# EAGLE design BLE112 Breakout Board v2.2 (EAGLE 7.5.0)
BLE112 Breakout Board v2.0 Full breakout board for all BLE112 functions, with optional LEDs, programming header, USB access, etc.
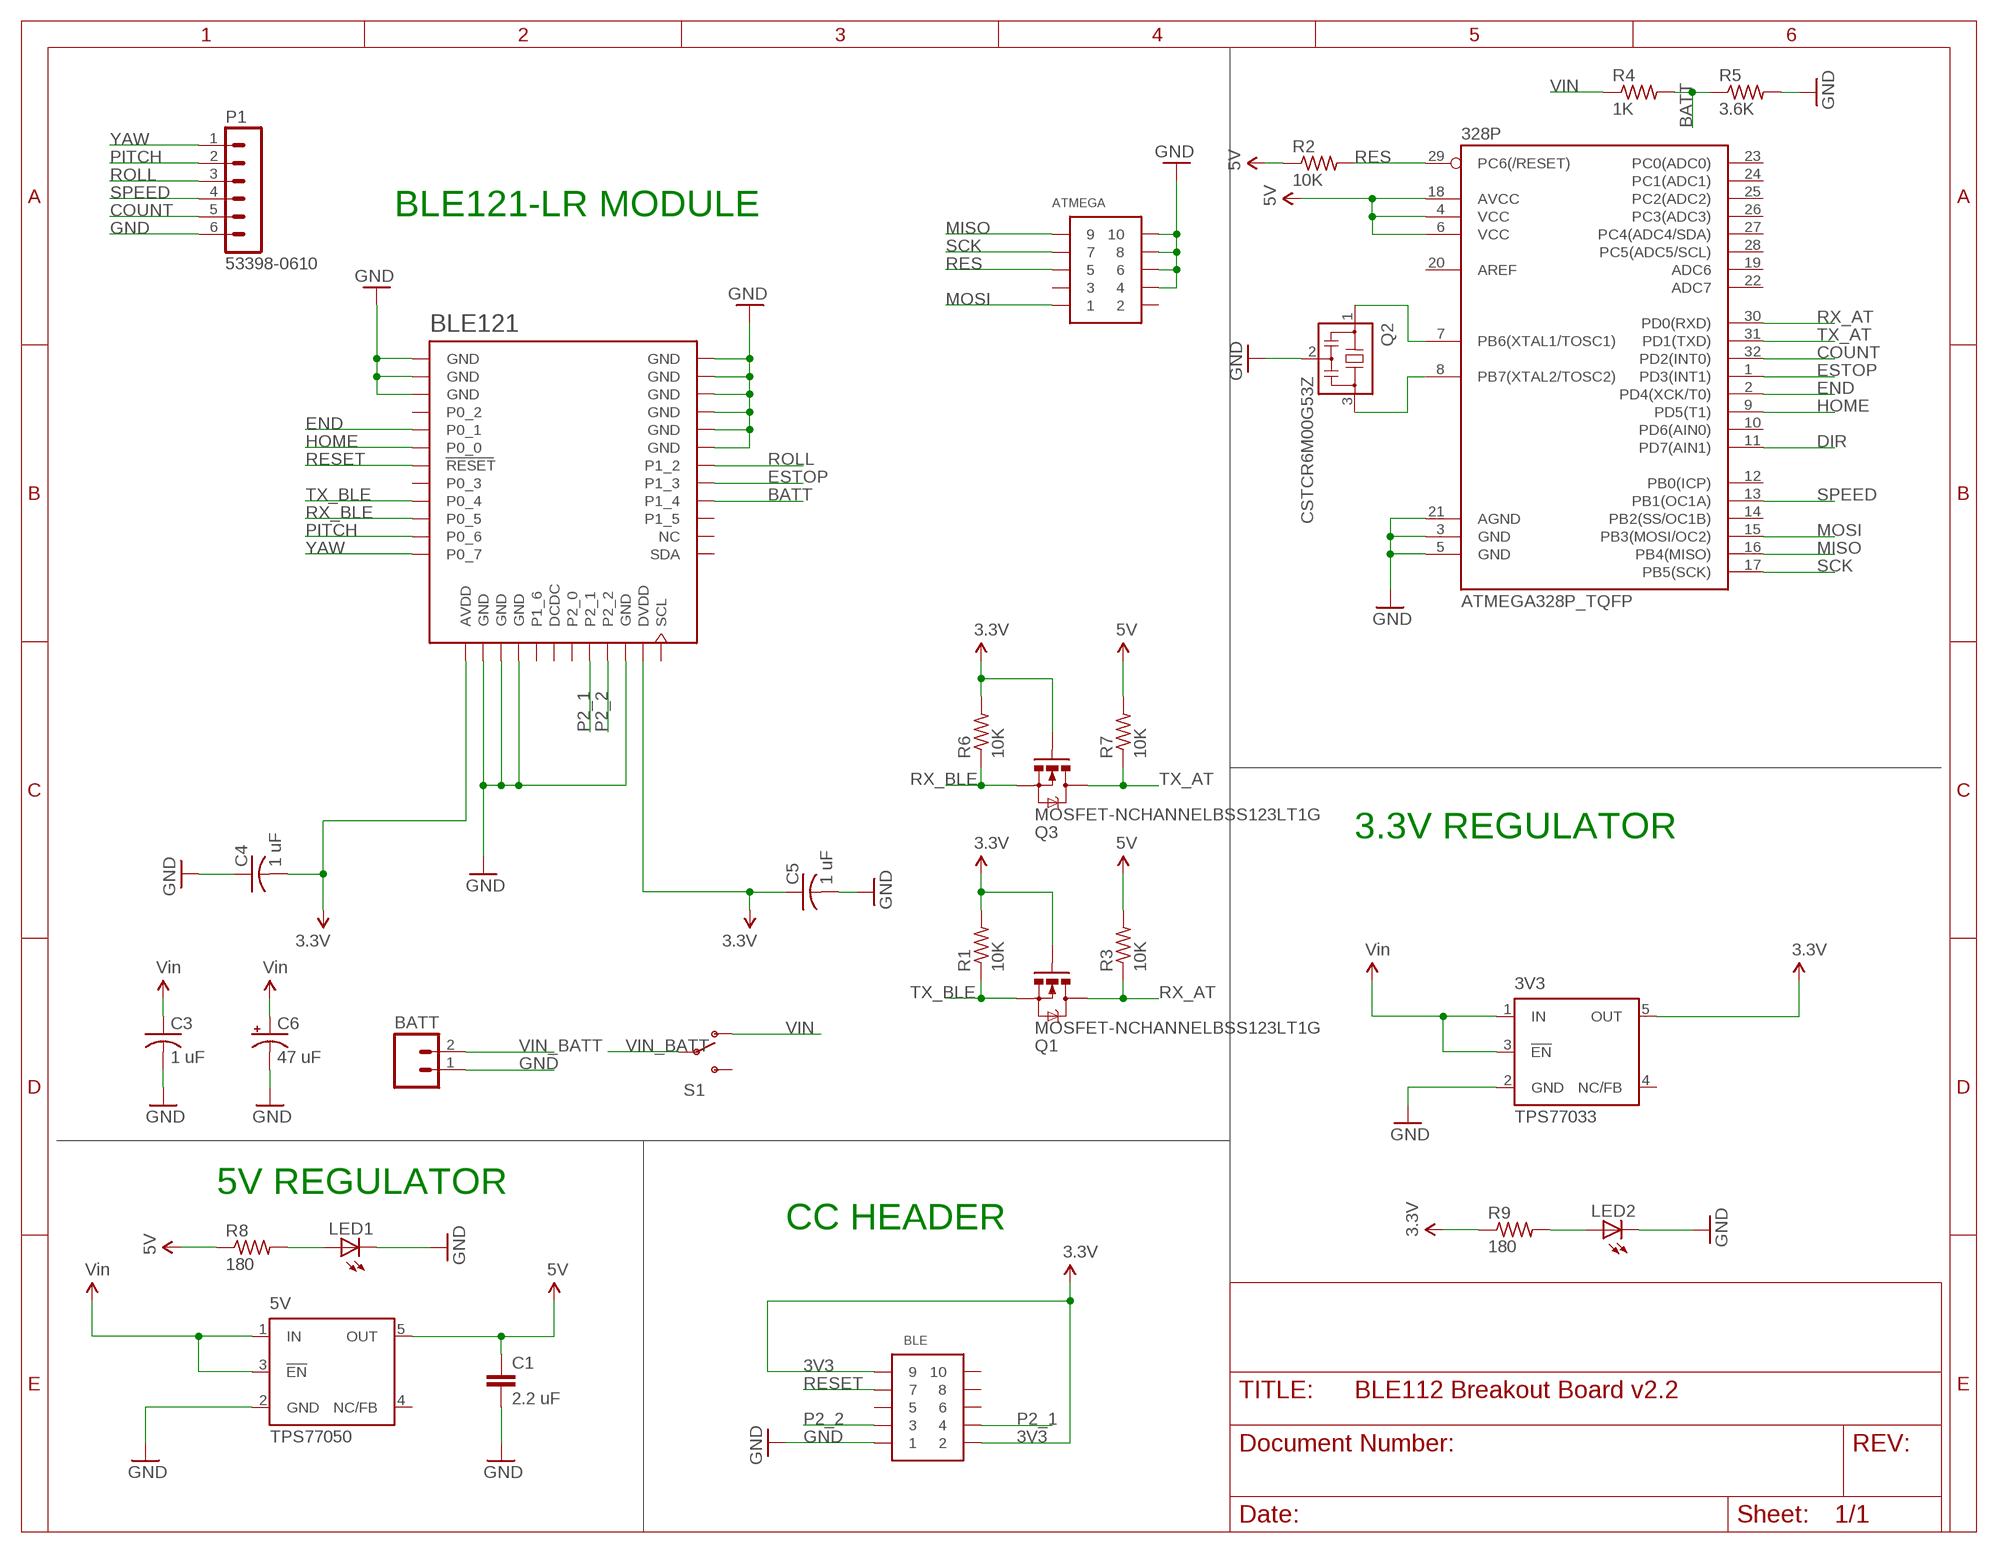
[diagram p0: schematic, sheet 1]

## Parts
3V3  TPS77033  [SOT23-DBV]
5V  TPS77050  [SOT23-DBV]
328P  ATMEGA328P_TQFP  [TQFP32-08]
ATMEGA  CONN_5-2-FTSH-V  [FTSH-105-DV]
BATT  M02JST-PTH-2  [JST-2-PTH]
BLE  CONN_5-2-FTSH-V  [FTSH-105-DV]
BLE121  BLE121LR-VISUAL-A  [BLE121LR-A]
C1  2.2 uF  CAP0603-CAP  [0603-CAP]
C3  1 uF  C-USC0402  [C0402]
C4  1 uF  C-USC0402  [C0402]
C5  1 uF  C-USC0402  [C0402]
C6  47 uF  CPOL-USD  [PANASONIC_D]
LED1  LEDSML0603  [SML0603]
LED2  LEDSML0603  [SML0603]
P1  53398-0610  [53398-0610]
Q1  MOSFET-NCHANNELBSS123LT1G  [SOT23-3]
Q2  CSTCR6M00G53Z  [CSTCR6M]
Q3  MOSFET-NCHANNELBSS123LT1G  [SOT23-3]
R1  10K  R-US_R0402  [R0402]
R2  10K  R-US_R0402  [R0402]
R3  10K  R-US_R0402  [R0402]
R4  1K  R-US_R0402  [R0402]
R5  3.6K  R-US_R0402  [R0402]
R6  10K  R-US_R0402  [R0402]
R7  10K  R-US_R0402  [R0402]
R8  180  R-US_R0402  [R0402]
R9  180  R-US_R0402  [R0402]
S1  SWITCH-SPDTSMD  [AYZ0202]

## Nets
3V3: 3V3.5(OUT) BLE121.AVDD BLE121.DVDD BLE.2 BLE.9 C4.2 C5.1 Q1.1(G) Q3.1(G) R1.2 R6.2 R9.1 ; supply symbol labelled 3.3V
5V: 5V.5(OUT) 328P.4(VCC) 328P.6(VCC) 328P.18(AVCC) C1.1 R2.1 R3.2 R7.2 R8.1
BATT: BLE121.P1_4 R4.2 R5.1
COUNT: 328P.32(PD2(INT0)) P1.5
DIR: 328P.11(PD7(AIN1))
END: 328P.2(PD4(XCK/T0)) BLE121.P0_1
ESTOP: 328P.1(PD3(INT1)) BLE121.P1_3
GND [power]: 3V3.2(GND) 5V.2(GND) 328P.3(GND) 328P.5(GND) 328P.21(AGND) ATMEGA.4 ATMEGA.6 ATMEGA.8 ATMEGA.10 BATT.1 BLE121.GND BLE121.GND@2(GND) BLE121.GND@3(GND) BLE121.GND@4(GND) BLE121.GND@5(GND) BLE121.GND@6(GND) BLE121.GND@7(GND) BLE121.GND@8(GND) BLE121.GND@9(GND) BLE121.GND@10(GND) BLE121.GND@11(GND) BLE121.GND@12(GND) BLE121.GND@13(GND) BLE.1 C1.2 C3.2 C4.1 C5.2 C6.- LED1.C LED2.C P1.6 Q2.2 R5.2
HOME: 328P.9(PD5(T1)) BLE121.P0_0
MISO: 328P.16(PB4(MISO)) ATMEGA.9
MOSI: 328P.15(PB3(MOSI/OC2)) ATMEGA.1
N$1: 328P.8(PB7(XTAL2/TOSC2)) Q2.3
N$2: 328P.7(PB6(XTAL1/TOSC1)) Q2.1
N$3: LED1.A R8.2
N$4: LED2.A R9.2
P2_1: BLE121.P2_1 BLE.4
P2_2: BLE121.P2_2 BLE.3
PITCH: BLE121.P0_6 P1.2
RES: 328P.29(PC6(/RESET)) ATMEGA.5 R2.2
RESET: BLE121.RESET BLE.7
ROLL: BLE121.P1_2 P1.3
RX_AT: 328P.30(PD0(RXD)) Q1.3(D) R3.1
RX_BLE: BLE121.P0_5 Q3.2(S) R6.1
SCK: 328P.17(PB5(SCK)) ATMEGA.7
SPEED: 328P.13(PB1(OC1A)) P1.4
TX_AT: 328P.31(PD1(TXD)) Q3.3(D) R7.1
TX_BLE: BLE121.P0_4 Q1.2(S) R1.1
VIN: 3V3.1(IN) 3V3.3(!EN) 5V.1(IN) 5V.3(!EN) C3.1 C6.+ R4.1 S1.1(O) ; supply symbol labelled Vin
VIN_BATT: BATT.2 S1.2(P)
YAW: BLE121.P0_7 P1.1
Unconnected: 3V3.4(NC/FB) 5V.4(NC/FB) 328P.10(PD6(AIN0)) 328P.12(PB0(ICP)) 328P.14(PB2(SS/OC1B)) 328P.19(ADC6) 328P.20(AREF) 328P.22(ADC7) 328P.23(PC0(ADC0)) 328P.24(PC1(ADC1)) 328P.25(PC2(ADC2)) 328P.26(PC3(ADC3)) 328P.27(PC4(ADC4/SDA)) 328P.28(PC5(ADC5/SCL)) ATMEGA.2 ATMEGA.3 BLE121.DCDC BLE121.NC BLE121.P0_2 BLE121.P0_3 BLE121.P1_5 BLE121.P1_6 BLE121.P2_0 BLE121.SCL BLE121.SDA BLE.5 BLE.6 BLE.8 BLE.10 S1.3(S)

## Notes on the sheet
- BLE121-LR MODULE
- 3.3V REGULATOR
- 5V REGULATOR
- CC HEADER

## Library data of the parts
3V3 = texas:TPS770*: ULTRALOW-POWER 50-mA LOW-DROPOUT LINEAR REGULATORS 50-mA Low-Dropout Regulator Source: http://focus.ti.com/lit/ds/symlink/tps77001.pdf; MF: TEXAS INSTRUMENTS; MPN: TPS77033DBVT; OC_FARNELL: 8461570; OC_NEWARK: 77C1187
5V = texas:TPS770*: ULTRALOW-POWER 50-mA LOW-DROPOUT LINEAR REGULATORS 50-mA Low-Dropout Regulator Source: http://focus.ti.com/lit/ds/symlink/tps77001.pdf; MF: TEXAS INSTRUMENT CONNECTORS; MPN: TPS77050DBVT; OC_FARNELL: 1412883; OC_NEWARK: 77C1189
328P = SparkFun-DigitalIC:ATMEGA328P_TQFP; PROD_ID: IC-09069
ATMEGA BLE = pel_misc:CONN_5-2
BATT = SparkFun-Connectors:M02: Standard 2-pin 0.1" header. Use with - straight break away headers ( PRT-00116) - right angle break away headers (PRT-00553) - swiss pins (PRT-00743) - machine pins (PRT-00117) - female headers (PRT-00115) Molex polarized connector foot print use with: PRT-08233 with associated crimp pins and housings. 2.54_SCREWTERM for use with PRT-10571. 3.5mm Screw Terminal footprints for PRT-08084 5mm Screw Terminal footprints for use with PRT-08432; PROD_ID: CONN-09863; SKU: PRT-09914
BLE121 = sf-bluegiga:BLE121LR-VISUAL: Bluetooth Low Energy single-mode long-range module - Bluetooth 4.0 (CC2541). BLE121LR-A variant has an on-module ceramic chip antenna. BLE121LR-A variant includes keepout/restrict area. Antenna edge of the module should be flush up against the edge of the PCB. See datasheet for variant layout details. IT IS EXTREMELY IMPORTANT THAT YOU FOLLOW THE LAYOUT GUIDELINES FOR THIS MODULE IN ORDER TO ENSURE MAXIMUM RANGE. THIS MEANS THAT YOU NEED A SOLID GROUND PLANE EXTENDING AT LEAST 17 mm ON THE LEFT AND RIGHT SIDES OF THE MODULE, AS SHOWN IN THE DATASHEET. BLE121LR is a Bluetooth Smart Long Range module targeted for Bluetooth Smart applications where the best possible RF performance and range are required. At +8 dBm TX power and -98 dBm sensitivity BLE121LR has best-in-class RF performance and can provide Bluetooth Smart connectivity up to 450 meters. BLE121LR integrates all features required for a Bluetooth Smart application: Bluetooth radio, software stack and GATT based profiles. and it can also host end user applications, which means no external micro controller is required in size, price or power constrained devices. BLE121LR Bluetooth Smart module also has flexible hardware interfaces to connect to different peripherals or sensors. Although BLE121LR Bluetooth Smart Long Range Module is target for applications requiring high RF performance, it is still has relatively low power consumption and can be power using a standard 3V coin cell batteries. https://www.bluegiga.com/en-US/products/bluetooth-4.0-modules/ble121lr-bluetooth--smart-long https://github.com/jrowberg/sf-oshw Last updated 2014-08-02 by Jeff Rowberg <jeff@rowberg.net>; ANTENNA: On-module ceramic chip antenna
C1 = SparkFun-Capacitors:CAP: Capacitor Standard 0603 ceramic capacitor, and 0.1" leaded capacitor.
C3-C5 = resistor:C-US: CAPACITOR, American symbol
C6 = rcl:CPOL-US: POLARIZED CAPACITOR, American symbol
LED1 LED2 = led:LED: LED OSRAM: - CHIPLED LG R971, LG N971, LY N971, LG Q971, LY Q971, LO R971, LY R971 LH N974, LH R974 LS Q976, LO Q976, LY Q976 LO Q996 - Hyper CHIPLED LW Q18S LB Q993, LB Q99A, LB R99A - SideLED LS A670, LO A670, LY A670, LG A670, LP A670 LB A673, LV A673, LT A673, LW A673 LH A674 LY A675 LS A676, LA A676, LO A676, LY A676, LW A676 LS A679, LY A679, LG A679 - Hyper Micro SIDELED® LS Y876, LA Y876, LO Y876, LY Y876 LT Y87S - SmartLED LW L88C, LW L88S LB L89C, LB L89S, LG L890 LS L89K, LO L89K, LY L89K LS L896, LA L896, LO L896, LY L896 - TOPLED LS T670, LO T670, LY T670, LG T670, LP T670 LSG T670, LSP T670, LSY T670, LOP T670, LYG T670 LG T671, LOG T671, LSG T671 LB T673, LV T673, LT T673, LW T673 LH T674 LS T676, LA T676, LO T676, LY T676, LB T676, LH T676, LSB T676, LW T676 LB T67C, LV T67C, LT T67C, LS T67K, LO T67K, LY T67K, LW E67C LS E67B, LA E67B, LO E67B, LY E67B, LB E67C, LV E67C, LT E67C LW T67C LS T679, LY T679, LG T679 LS T770, LO T770, LY T770, LG T770, LP T770 LB T773, LV T773, LT T773, LW T773 LH T774 LS E675, LA E675, LY E675, LS T675 LS T776, LA T776, LO T776, LY T776, LB T776 LHGB T686 LT T68C, LB T68C - Hyper Mini TOPLED® LB M676 - Mini TOPLED Santana® LG M470 LS M47K, LO M47K, LY M47K Source: http://www.osram.convergy.de LUXEON: - LUMILED® LXK2-PW12-R00, LXK2-PW12-S00, LXK2-PW14-U00, LXK2-PW14-V00 LXK2-PM12-R00, LXK2-PM12-S00, LXK2-PM14-U00 LXK2-PE12-Q00, LXK2-PE12-R00, LXK2-PE12-S00, LXK2-PE14-T00, LXK2-PE14-U00 LXK2-PB12-K00, LXK2-PB12-L00, LXK2-PB12-M00, LXK2-PB14-N00, LXK2-PB14-P00, LXK2-PB14-Q00 LXK2-PR12-L00, LXK2-PR12-M00, LXK2-PR14-Q00, LXK2-PR14-R00 LXK2-PD12-Q00, LXK2-PD12-R00, LXK2-PD12-S00 LXK2-PH12-R00, LXK2-PH12-S00 LXK2-PL12-P00, LXK2-PL12-Q00, LXK2-PL12-R00 Source: www.luxeon.com KINGBRIGHT: KA-3528ASYC Source: www.kingbright.com
P1 = con-molex-picoblade:53398-0610: HEADER
Q1 Q3 = SparkFun-DiscreteSemi:MOSFET-NCHANNEL: Common NMOSFET Parts MFG P/N Store ID Prod ID FDD8780 TRANS-09984 SI7820DN TRANS-11055 FDS6630A IC-08089 2N7002PW TRANS-11151 FQP30N06L COM-10213 TRANS-10060 BSS123LT1G TRANS-08345 BSS138 TRANS-00830 BS170 2N7000; PROD_ID: TRANS-08345
Q2 = murata-filter:CSTCR: Resonator Source: murata.co.jp; MPN: CSTCR6M00G53-R0; OC_FARNELL: 1170434; OC_NEWARK: 25M8759
R1-R9 = adafruit:R-US_: RESISTOR, American symbol
S1 = SparkFun-Electromechanical:SWITCH-SPDT: SPDT Switch Simple slide switch, Spark Fun Electronics SKU : COM-00102 DPDT SMT slide switch, AYZ0202, SWCH-08179; PROD_ID: SWCH-08179; SF_ID: COM-00597

## Net classes
0 default: width 0.152 mm, drill 0.33 mm, clearance 0.152 mm
1 power: width 0.254 mm, drill 0.33 mm, clearance 0.152 mm

## Board
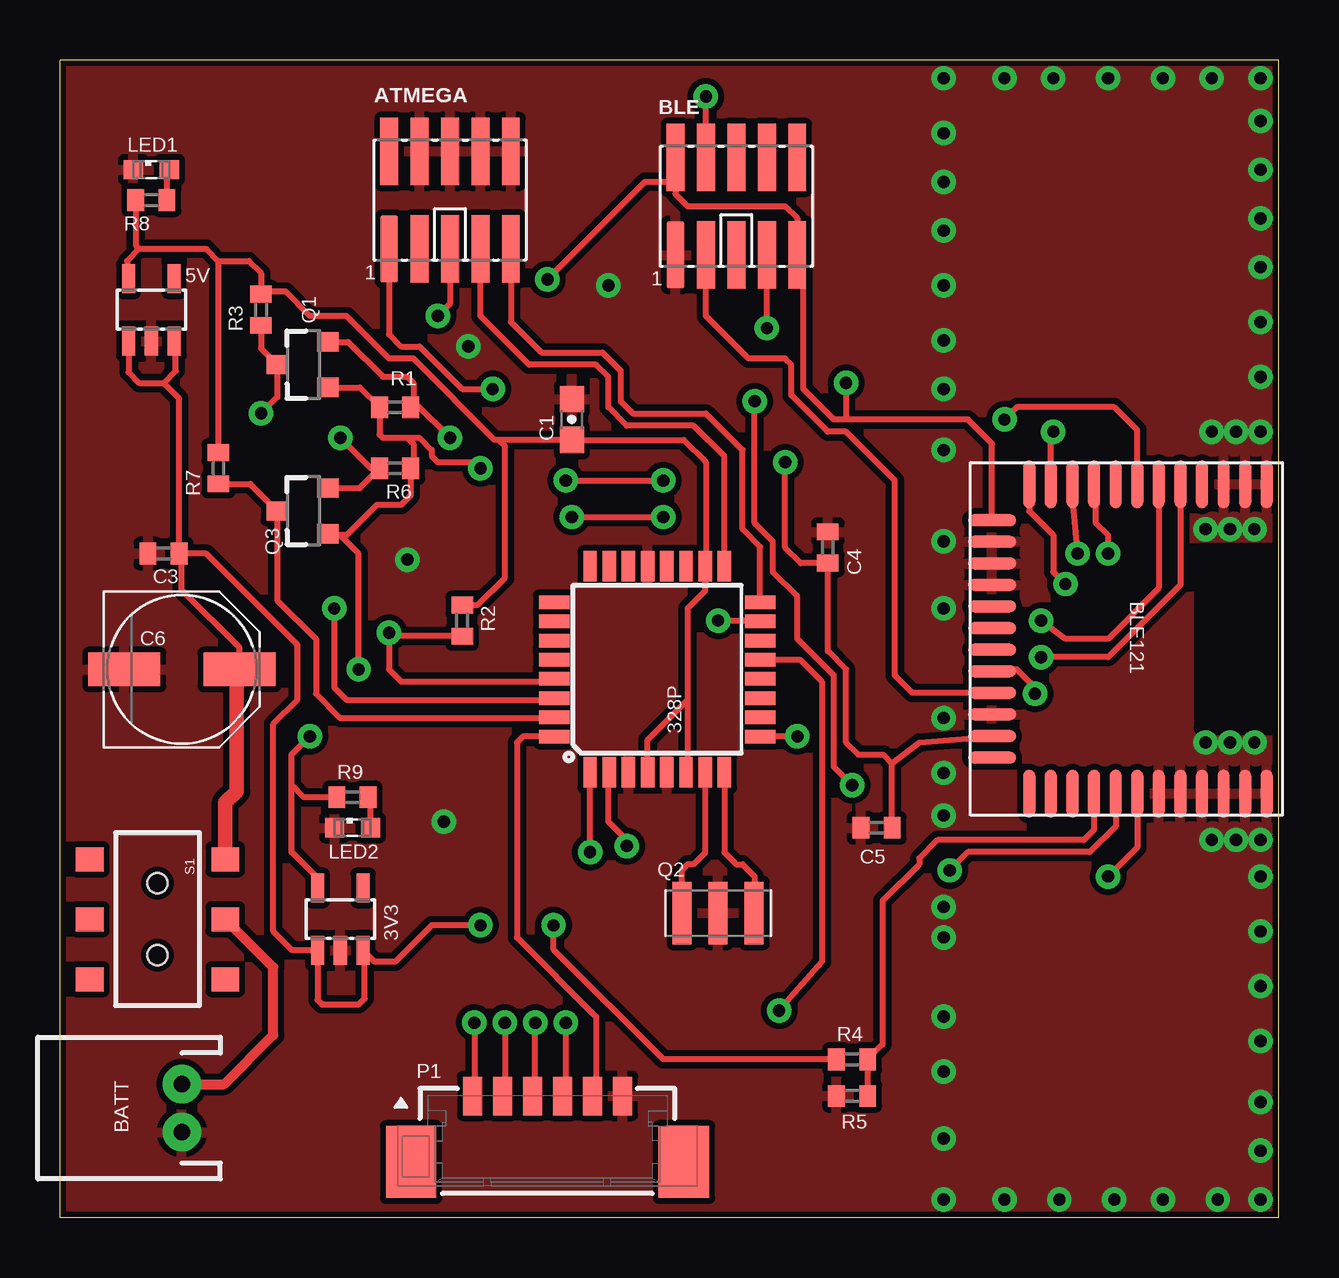
[diagram p1: board, top side]
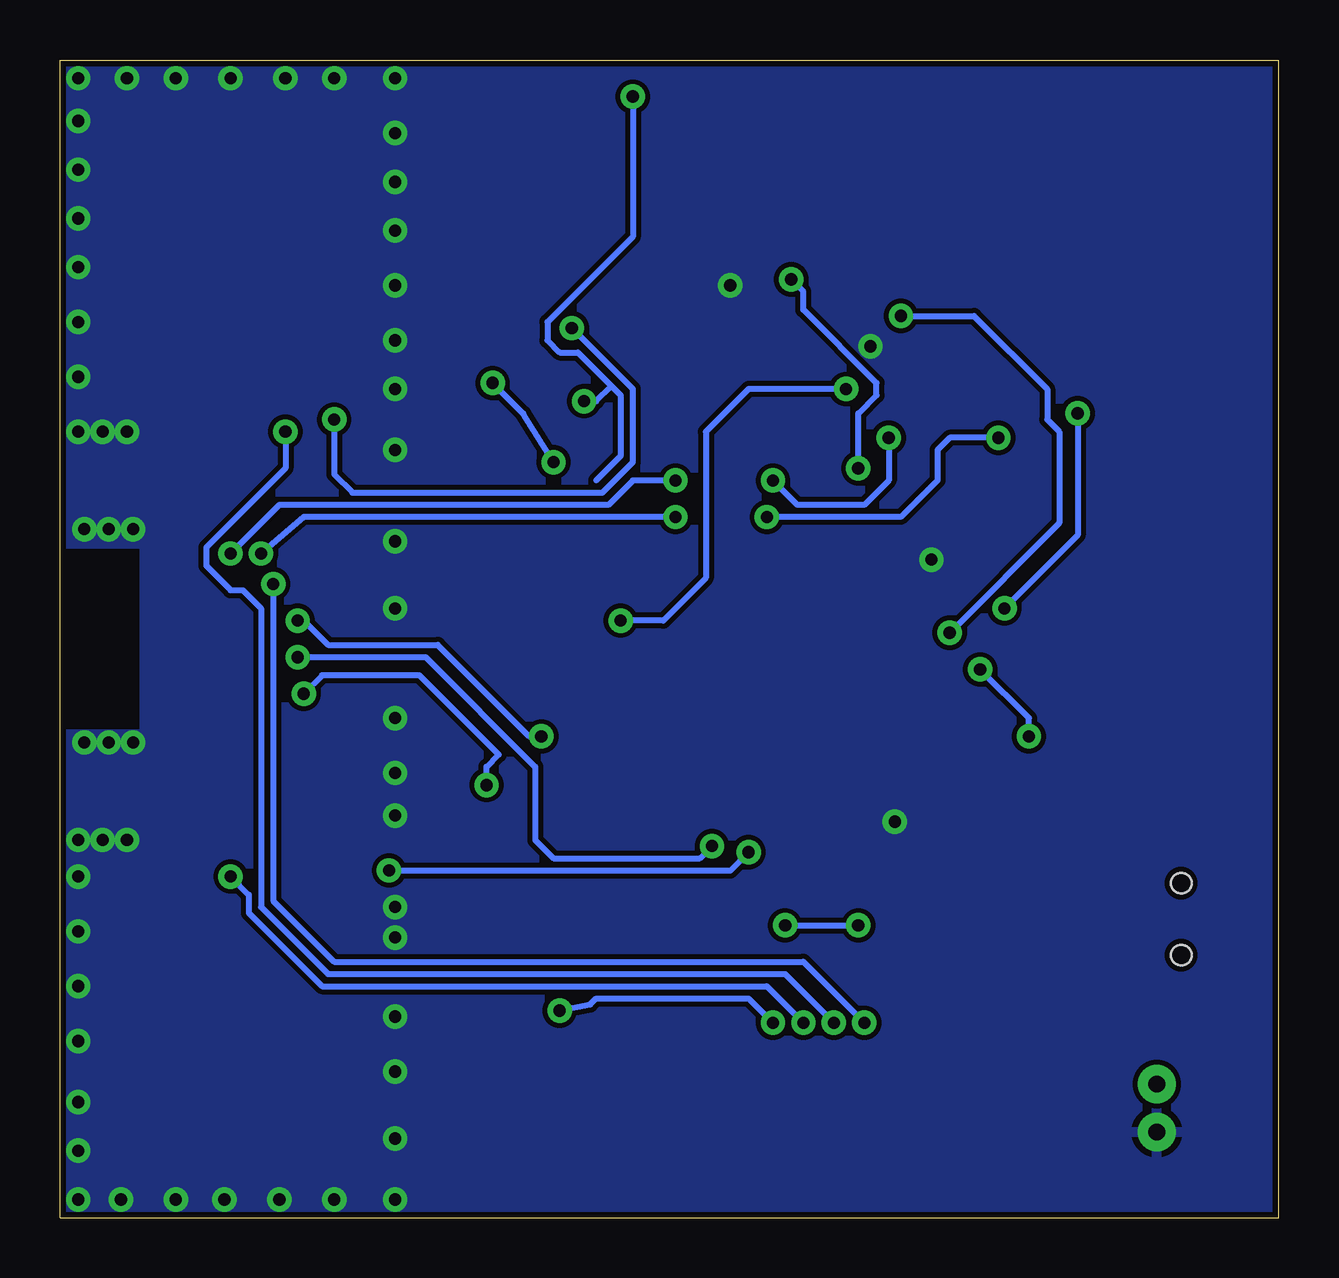
[diagram p2: board, bottom side, seen from below]

Size 50.8 x 48.26 mm. Coordinates in mm from the lower left corner, seen from the top.
Outline: 50.8,0 50.8,48.26 0,48.26 0,0 50.8,0
Copper layers (1*16): Top 0.035mm / dielectric 1.5mm / Bottom 0.035mm
Design rules "SparkFun": minimum track width 8mil, minimum drill 20mil, track to track 8mil, track to pad 8mil, pad to pad 8mil, via to via 8mil, smd to smd 8mil, copper to edge 10mil, drill to drill 8mil, minimum pad ring 12mil, minimum via ring 10mil, stop-mask expansion 4mil, vias tented up to drill 25mil, thermal gap 10mil

### Footprints (pad centres in the part's own frame; a part is rotated, then mirrored left to right if it is on the bottom)
SOT23-DBV = smd 0.55 x 1.2: 1 -0.95,-1.3; 2 0,-1.3; 3 0.95,-1.3; 4 0.95,1.3; 5 -0.95,1.3
TQFP32-08 = smd 1.27 x 0.559: 1 -4.293,2.8; 2 -4.293,2; 3 -4.293,1.2; 4 -4.293,0.4; 5 -4.293,-0.4; 6 -4.293,-1.2; 7 -4.293,-2; 8 -4.293,-2.8; 17 4.293,-2.8; 18 4.293,-2; 19 4.293,-1.2; 20 4.293,-0.4; 21 4.293,0.4; 22 4.293,1.2; 23 4.293,2; 24 4.293,2.8 | smd 0.559 x 1.27: 9 -2.8,-4.293; 10 -2,-4.293; 11 -1.2,-4.293; 12 -0.4,-4.293; 13 0.4,-4.293; 14 1.2,-4.293; 15 2,-4.293; 16 2.8,-4.293; 25 2.8,4.293; 26 2,4.293; 27 1.2,4.293; 28 0.4,4.293; 29 -0.4,4.293; 30 -1.2,4.293; 31 -2,4.293; 32 -2.8,4.293
FTSH-105-DV = smd 0.74 x 2.8: 1 -2.54,-2.03; 2 -2.54,2.03; 3 -1.27,-2.03; 4 -1.27,2.03; 5 0,-2.03; 6 0,2.03; 7 1.27,-2.03; 8 1.27,2.03; 9 2.54,-2.03; 10 2.54,2.03
JST-2-PTH = drill 0.7 pad 1.6: 1 -1,0; 2 1,0
BLE121LR-A = smd 0.5 x 2: AVDD -4.95,-5.6; DCDC -0.45,-5.6; DVDD 4.05,-5.6; GND@4 -4.05,-5.6; GND@5 -3.15,-5.6; GND@6 -2.25,-5.6; GND@7 3.15,-5.6; P1_6 -1.35,-5.6; P2_0 0.45,-5.6; P2_1 1.35,-5.6; P2_2 2.25,-5.6; SCL 4.95,-5.6 | smd 2 x 0.5: GND -6.45,5.85; GND@2 -6.45,4.95; GND@3 -6.45,4.05; GND@8 6.45,1.35; GND@9 6.45,2.25; GND@10 6.45,3.15; GND@11 6.45,4.05; GND@12 6.45,4.95; GND@13 6.45,5.85; NC 6.45,-3.15; P0_0 -6.45,1.35; P0_1 -6.45,2.25; P0_2 -6.45,3.15; P0_3 -6.45,-0.45; P0_4 -6.45,-1.35; P0_5 -6.45,-2.25; P0_6 -6.45,-3.15; P0_7 -6.45,-4.05; P1_2 6.45,0.45; P1_3 6.45,-0.45; P1_4 6.45,-1.35; P1_5 6.45,-2.25; RESET -6.45,0.45; SDA 6.45,-4.05
0603-CAP = smd 1.1 x 1: 1 -0.85,0; 2 0.85,0
C0402 = smd 0.7 x 0.9: 1 -0.65,0; 2 0.65,0
PANASONIC_D = smd 3 x 1.4: + 2.4,0; - -2.4,0
SML0603 = smd 0.8 x 0.8: A 0.75,0; C -0.75,0
53398-0610 = smd 0.8 x 1.6: 1 3.125,0; 2 1.875,0; 3 0.625,0; 4 -0.625,0; 5 -1.875,0; 6 -3.125,0 | smd 2.1 x 3: M1 5.685,2.75; M2 -5.685,2.75
SOT23-3 = smd 0.8 x 0.9: 1 -0.95,-1; 2 0.95,-1; 3 0,1.1
CSTCR6M = smd 0.8 x 2.6: 1 -1.5,0; 2 0,0; 3 1.5,0
R0402 = smd 0.7 x 0.9: 1 -0.65,0; 2 0.65,0
AYZ0202 = smd 1 x 1.15: 1 -2.5,2.825; 2 0,2.825; 3 2.5,2.825; 4 -2.5,-2.825; 5 0,-2.825; 6 2.5,-2.825 | hole 0.85: 1.5,0; -1.5,0

### Placement (x,y rotation side)
3V3  11.68,12.45 0 top
5V  3.81,37.85 0 top
328P  24.89,22.86 90 top
ATMEGA  16.26,42.42 0 top
BATT  5.08,4.57 90 top
BLE  28.19,42.16 0 top
BLE121  44.45,24.13 270 top
C1  21.34,33.27 90 top
C3  4.32,27.69 180 top
C4  32,27.94 270 top
C5  34.04,16.26 180 top
C6  5.08,22.86 0 top
LED1  3.81,43.69 0 top
LED2  12.19,16.26 0 top
P1  20.32,5.08 180 top
Q1  10.16,35.56 90 top
Q2  27.43,12.7 0 top
Q3  10.16,29.46 90 top
R1  13.97,33.78 180 top
R2  16.76,24.89 270 top
R3  8.38,37.85 90 top
R4  33.02,6.6 0 top
R5  33.02,5.08 180 top
R6  13.97,31.24 0 top
R7  6.6,31.24 90 top
R8  3.81,42.42 0 top
R9  12.19,17.53 0 top
S1  4.06,12.45 270 top

### Tracks (layer width: path | path; a pad name or v marks a point on that pad's centre or on a via)
3V3  (via drill 0.51)
  Top 0.254: BLE.2 25.65,43.18 | 25.65,43.18 25.65,42.67 26.16,42.16 30.23,42.16 30.73,41.66 BLE.9 30.99,39.88 30.99,34.54 32.26,33.27 32.77,33.27 | Q1.1 12.49,34.61 R1.2 13.32,32.65 13.46,32.51 14.48,32.51 | 14.48,32.51 14.73,32.26 14.73,31.35 R6.2 14.62,30.11 14.22,29.72 13.21,29.72 11.94,28.45 11.68,28.45 | 11.68,28.45 11.23,28.45 Q3.1 | 3V3.5 10.73,14.16 9.65,15.24 9.65,18.03 | 9.65,18.03 9.65,19.3 v10.41,20.07 | v12.45,22.86 12.45,27.69 11.68,28.45 | R9.1 10.16,17.53 9.65,18.03 | BLE121.AVDD 38.85,32.27 37.85,33.27 32.77,33.27 | C5.1 34.69,18.94 | 34.69,18.94 35.81,19.81 38.84,20.07 BLE121.DVDD | 34.69,18.94 34.32,19.3 33.27,19.3 32.77,19.81 32.77,22.86 32,23.62 C4.2 30.88,27.29 30.23,27.94 v30.23,31.5 | v32.77,34.8 32.77,33.27 | 14.48,32.51 14.99,32.51 15.49,32 15.49,31.75 15.75,31.5 17.27,31.5 v17.53,31.24 | v20.32,39.12 24.38,43.18 25.65,43.18
  Bottom 0.254: v10.41,20.07 10.41,20.83 v12.45,22.86 | v30.23,31.5 31.5,33.53 v32.77,34.8 | v17.53,31.24 17.53,33.53 16.76,34.29 16.76,34.8 19.81,37.85 19.81,38.61 v20.32,39.12
5V
  Top 0.254: 3.3,40.39 2.79,39.88 2.79,39.21 5V.5 | R8.1 3.16,40.53 3.3,40.39 | 3.3,40.39 6.1,40.39 6.6,39.88 | 6.6,39.88 R7.2 | 6.6,39.88 7.87,39.88 8.38,39.37 R3.2 8.49,38.61 9.4,38.61 10.41,37.59 11.94,37.59 13.72,35.81 14.73,35.81 18.12,32.42 18.29,32.42 | 18.29,32.42 C1.1 26,32.42 26.92,31.5 26.92,27.18 328P.18 26.89,26.13 26.16,25.4 26.16,21.59 | R2.1 17.41,25.54 18.54,26.67 18.54,32.17 18.29,32.42 | 26.16,21.59 26.16,18.64 328P.6 | 328P.4 24.49,19.92 26.16,21.59
BATT
  Top 0.254: R5.1 R4.2 34.29,7.22 34.29,13.21 35.81,14.73 35.81,14.99 36.58,15.75 42.67,15.75 43.1,16.18 BLE121.P1_4
COUNT
  Top 0.254: 328P.32 19.3,20.06 19.05,19.81 19.05,11.68 22.35,8.38 22.35,5.24 P1.5
END  (via drill 0.51)
  Top 0.254: BLE121.P0_1 46.7,26.38 43.69,23.37 v40.89,23.37 | v23.62,15.49 23.62,15.75 22.86,16.51 22.86,18.54 328P.2
  Bottom 0.254: v40.89,23.37 35.56,23.37 30.99,18.8 30.99,15.75 30.23,14.99 24.13,14.99 v23.62,15.49
ESTOP  (via drill 0.51)
  Top 0.254: BLE121.P1_3 44,16.31 42.93,15.24 37.85,15.24 v37.08,14.48 | v22.1,15.24 328P.1
  Bottom 0.254: v37.08,14.48 22.86,14.48 v22.1,15.24
GND  (via drill 0.51)
  other vias: 49.78,28.7 48.77,28.7 47.75,28.7 49.78,19.81 48.77,19.81 47.75,19.81 48.01,15.75 49.02,15.75 50.04,15.75 50.04,14.22 50.04,11.94 50.04,9.65 50.04,7.37 50.04,4.83 50.04,2.79 50.04,0.76 48.26,0.76 45.97,0.76 43.94,0.76 41.66,0.76 39.37,0.76 36.83,0.76 36.83,3.3 36.83,6.1 36.83,8.38 36.83,41.15 36.83,43.18 36.83,45.21 36.83,47.5 39.37,47.5 41.4,47.5 43.69,47.5 45.97,47.5 48.01,47.5 50.04,47.5 50.04,45.72 50.04,43.69 50.04,41.66 50.04,39.62 50.04,37.34 50.04,35.05 50.04,32.77 49.02,32.77 48.01,32.77 17.02,36.32 36.83,11.68 36.83,12.95 36.83,16.76 36.83,18.54 36.83,20.83 36.83,25.4 36.83,28.19 36.83,32 36.83,34.54 36.83,36.58 36.83,38.86 14.48,27.43 22.86,38.86 16,16.51
  pour Bottom: 0,48.26 50.8,48.26 50.8,0 0,0
  pour Top (isolate 0.254): 50.8,48.26 0,48.26 0,0 50.8,0
HOME  (via drill 0.51)
  Top 0.254: BLE121.P0_0 45.8,26.24 43.69,24.13 41.91,24.13 v40.89,24.89 | v30.73,20.07 328P.9
  Bottom 0.254: v40.89,24.89 40.64,24.89 39.62,23.88 35.05,23.88 31.24,20.07 v30.73,20.07
MISO
  Top 0.254: ATMEGA.9 18.8,37.34 20.07,36.07 22.61,36.07 23.37,35.31 23.37,34.04 23.88,33.53 26.92,33.53 28.45,32 28.45,28.7 29.18,27.96 328P.16 29.21,25.68
MOSI  (via drill 0.51)
  Top 0.254: ATMEGA.1 13.72,36.83 14.22,36.32 14.99,36.32 16.76,34.54 v18.03,34.54 | v27.43,24.89 29.15,24.89 328P.15
  Bottom 0.254: v18.03,34.54 22.1,34.54 23.88,32.77 23.88,26.67 25.65,24.89 v27.43,24.89
N$1
  Top 0.254: 328P.8 27.69,15.23 28.19,14.73 28.45,14.73 28.96,14.22 28.96,12.72 Q2.3
N$2
  Top 0.254: 328P.7 26.89,15.21 26.42,14.73 26.16,14.73 25.91,14.48 25.91,12.72 Q2.1
N$3
  Top 0.254: R8.2 4.46,43.59 LED1.A
N$4
  Top 0.254: LED2.A 12.94,17.43 R9.2
P2_1  (via drill 0.51)
  Top 0.254: BLE.4 v26.92,46.74 | v33.02,18.03 32.26,18.8 32.26,22.61 30.73,24.13 30.73,25.91 29.72,26.92 29.72,28.19 28.96,28.96 v28.96,34.04 | v40.64,21.84 40.64,22.1 39.88,22.86 38.93,22.86 BLE121.P2_1
  Bottom 0.254: v26.92,46.74 26.92,40.89 30.48,37.34 30.48,36.58 29.97,36.07 29.21,36.07 27.81,34.67 | 27.81,34.67 27.43,34.29 27.43,31.75 28.45,30.73 | v33.02,18.03 33.02,18.8 32.51,19.3 35.81,22.61 39.88,22.61 v40.64,21.84 | v28.96,34.04 28.45,34.04 27.81,34.67
P2_2
  Top 0.254: BLE121.P2_2 35.52,21.88 34.8,22.61 34.8,30.73 32.77,32.77 32,32.77 30.48,34.29 30.48,35.56 30.23,35.81 28.7,35.81 26.92,37.59 BLE.3
PITCH  (via drill 0.51)
  Top 0.254: BLE121.P0_6 41.3,32.66 v41.4,32.77 | v18.54,8.13 18.54,5.18 P1.2
  Bottom 0.254: v41.4,32.77 41.4,31.24 44.7,27.94 44.7,27.18 43.69,26.16 43.18,26.16 42.42,25.4 42.42,12.95 39.62,10.16 20.57,10.16 v18.54,8.13
RES  (via drill 0.51)
  Top 0.254: 328P.29 20.49,22.35 14.22,22.35 13.72,22.86 v13.72,24.38 13.86,24.24 R2.2 | ATMEGA.5 16.26,38.1 v15.75,37.59
  Bottom 0.254: v15.75,37.59 12.7,37.59 9.65,34.54 9.65,33.27 9.14,32.77 9.14,28.96 v13.72,24.38
RESET  (via drill 0.51)
  Top 0.254: BLE121.RESET 44.9,32.82 43.94,33.78 39.88,33.78 v39.37,33.27 | v29.46,37.08 BLE.7
  Bottom 0.254: v39.37,33.27 39.37,30.99 38.61,30.23 28.19,30.23 26.92,31.5 26.92,34.54 v29.46,37.08
ROLL  (via drill 0.51)
  Top 0.254: BLE121.P1_2 44.9,15.44 v43.69,14.22 | P1.3 19.81,5.2 v19.81,8.13
  Bottom 0.254: v43.69,14.22 42.93,13.46 42.93,12.7 39.88,9.65 21.34,9.65 v19.81,8.13
RX_AT  (via drill 0.51)
  Top 0.254: R3.1 8.38,36.24 Q1.3 9.06,34.21 v8.38,33.53 | v11.43,25.4 11.43,22.1 11.94,21.59 20.53,21.59 328P.30
  Bottom 0.254: v8.38,33.53 8.38,28.45 v11.43,25.4
RX_BLE  (via drill 0.51)
  Top 0.254: Q3.2 12.49,30.41 R6.1 12.95,31.24 v11.68,32.51 | v21.34,29.21 v25.15,29.21 | v42.42,27.69 42.16,30.54 BLE121.P0_5
  Bottom 0.254: v11.68,32.51 13.72,32.51 14.22,32 14.22,30.73 15.75,29.21 v21.34,29.21 | v25.15,29.21 40.64,29.21 v42.42,27.69
SCK
  Top 0.254: 328P.17 27.69,31.74 26.42,33.02 23.62,33.02 22.86,33.78 22.86,35.05 22.35,35.56 19.56,35.56 17.53,37.59 ATMEGA.7
SPEED  (via drill 0.51)
  Top 0.254: 328P.13 30.84,23.26 31.75,22.35 31.75,10.67 v29.97,8.64 | v21.08,8.13 21.08,5.22 P1.4
  Bottom 0.254: v29.97,8.64 28.7,8.89 28.45,9.14 22.1,9.14 v21.08,8.13
TX_AT
  Top 0.254: 328P.31 20.57,20.83 11.68,20.83 10.67,21.84 10.67,24.13 9.06,25.74 Q3.3 7.93,30.59 R7.1
TX_BLE  (via drill 0.51)
  Top 0.254: Q1.2 12,36.51 13.46,35.05 14.48,35.05 14.73,34.8 14.73,33.89 | 14.73,33.89 R1.1 | 14.73,33.89 14.87,33.89 v16.26,32.51 | v21.08,30.73 v25.15,30.73 | v43.69,27.69 43.69,28.45 43.18,28.96 43.18,30.5 BLE121.P0_4
  Bottom 0.254: v16.26,32.51 16.26,30.73 17.27,29.72 20.07,29.72 v21.08,30.73 | v25.15,30.73 26.92,30.73 27.94,29.72 41.66,29.72 v43.69,27.69
VIN  (via drill 0.51)
  Top 0.254: C6.+ 7.48,23.76 5.08,26.16 5.08,27.57 C3.1 | 5V.1 2.86,35.24 3.3,34.8 4.32,34.8 | 4.32,34.8 4.83,35.31 4.83,36.48 5V.3 | C3.1 6.1,27.69 9.91,23.88 9.91,21.59 8.89,20.57 8.89,11.94 9.68,11.15 3V3.1 10.73,9.08 10.92,8.89 12.45,8.89 12.7,9.14 12.7,11.08 3V3.3 13.11,10.67 13.97,10.67 15.49,12.19 v17.53,12.19 | C3.1 4.97,34.15 4.32,34.8 | R4.1 25.15,6.6 20.57,11.18 v20.57,12.19
  Top 0.61: C6.+ 7.37,22.75 7.37,17.78 6.89,17.3 S1.1
  Bottom 0.254: v20.57,12.19 v17.53,12.19
VIN_BATT
  Top 0.406: BATT.2 6.84,5.57 8.89,7.62 8.89,10.45 S1.2
YAW  (via drill 0.51)
  Top 0.254: BLE121.P0_7 40.4,29.45 41.4,28.45 41.4,26.92 v41.91,26.42 | v17.27,8.13 17.27,5.16 P1.1
  Bottom 0.254: v41.91,26.42 41.91,13.21 39.37,10.67 19.81,10.67 v17.27,8.13

### Text on the board
tNames: 1 | 1